# Altium schematic sheet COVERPAGE.SchDoc
size 420 x 297 mm; SheetNumber: 1; SheetTotal: 5
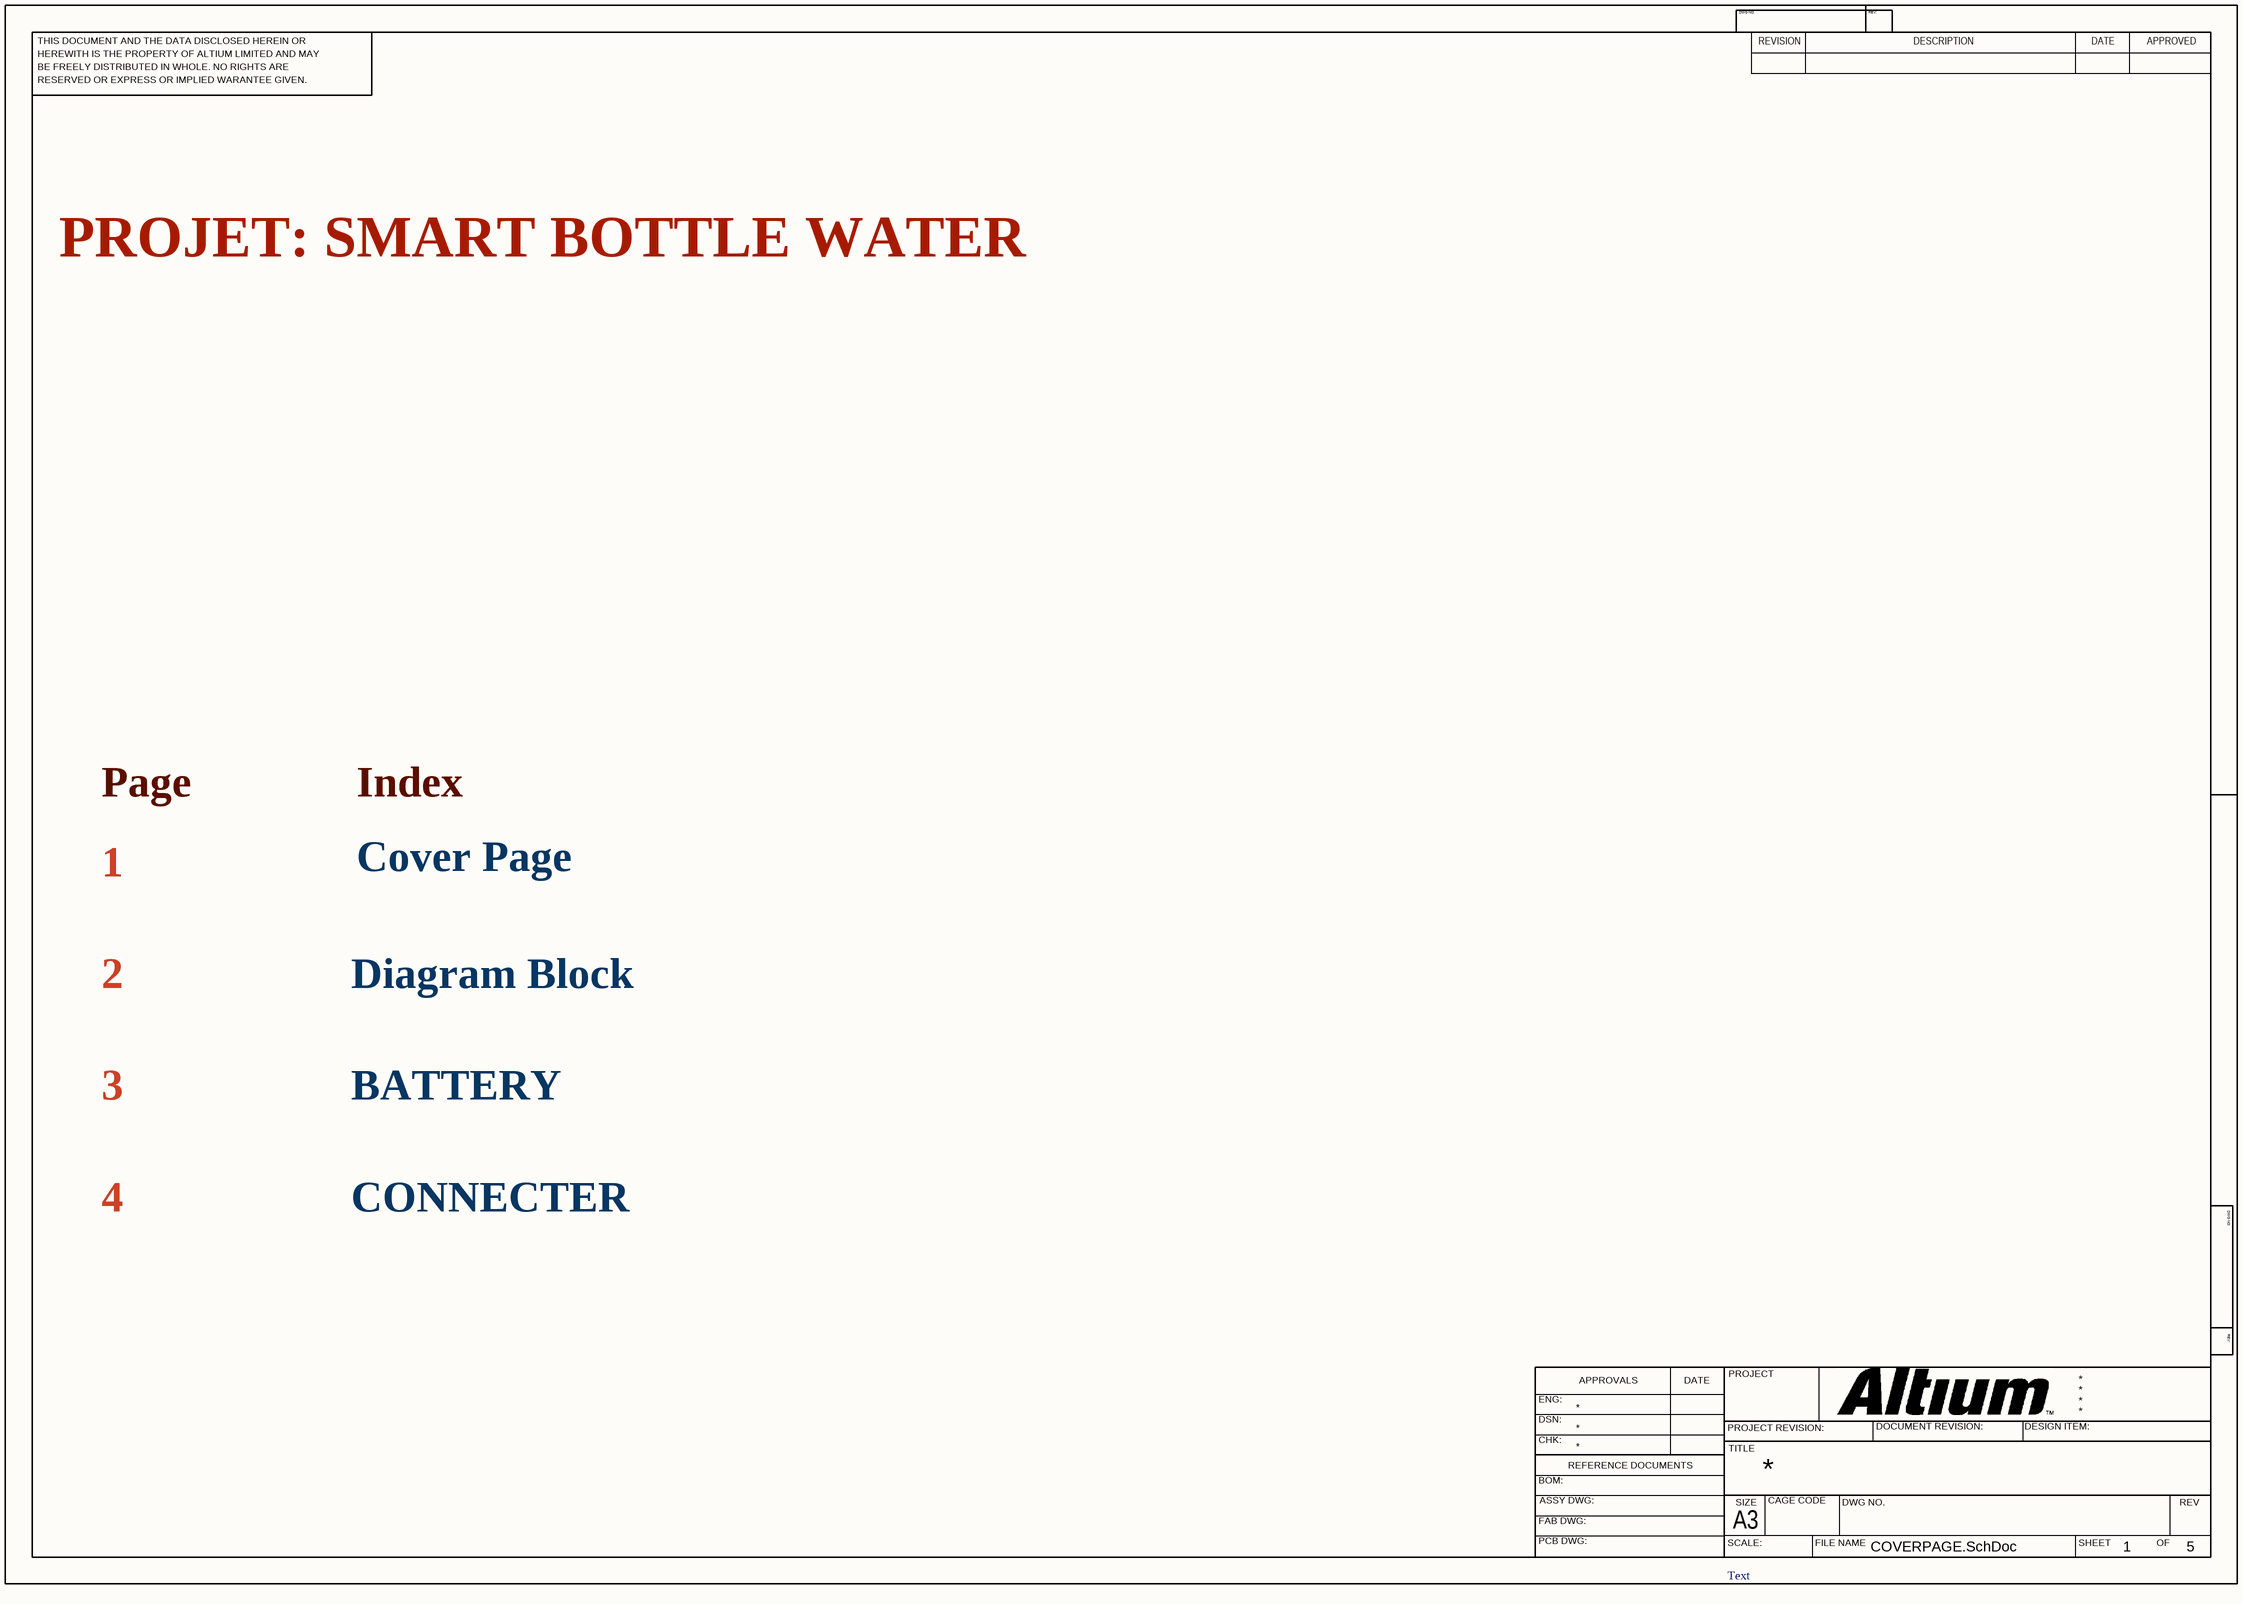
[diagram p0: COVERPAGE.SchDoc]

## Notes on the sheet
- PROJET: SMART BOTTLE WATER
- Page               Index
- 1
- Cover Page
- 2
- Diagram Block
- 3
- BATTERY
- 4
- CONNECTER
- Text
- THIS DOCUMENT AND THE DATA DISCLOSED HEREIN OR
- HEREWITH IS THE PROPERTY OF ALTIUM LIMITED AND MAY
- DWG NO:
- REVISION
- REV:
- DESCRIPTION
- DATE
- APPROVED
- BE FREELY DISTRIBUTED IN WHOLE. NO RIGHTS ARE
- RESERVED OR EXPRESS OR IMPLIED WARANTEE GIVEN.
- ENG:
- APPROVALS
- PROJECT
- DSN:
- CHK:
- REFERENCE DOCUMENTS
- PROJECT REVISION:
- TITLE
- DOCUMENT REVISION:
- DESIGN ITEM:
- BOM:
- FAB DWG:
- PCB DWG:
- ASSY DWG:
- SCALE:
- A3
- SIZE
- CAGE CODE
- FILE NAME
- DWG NO.
- SHEET
- OF
- REV